# EAGLE design in3brain (EAGLE 7.7.0)
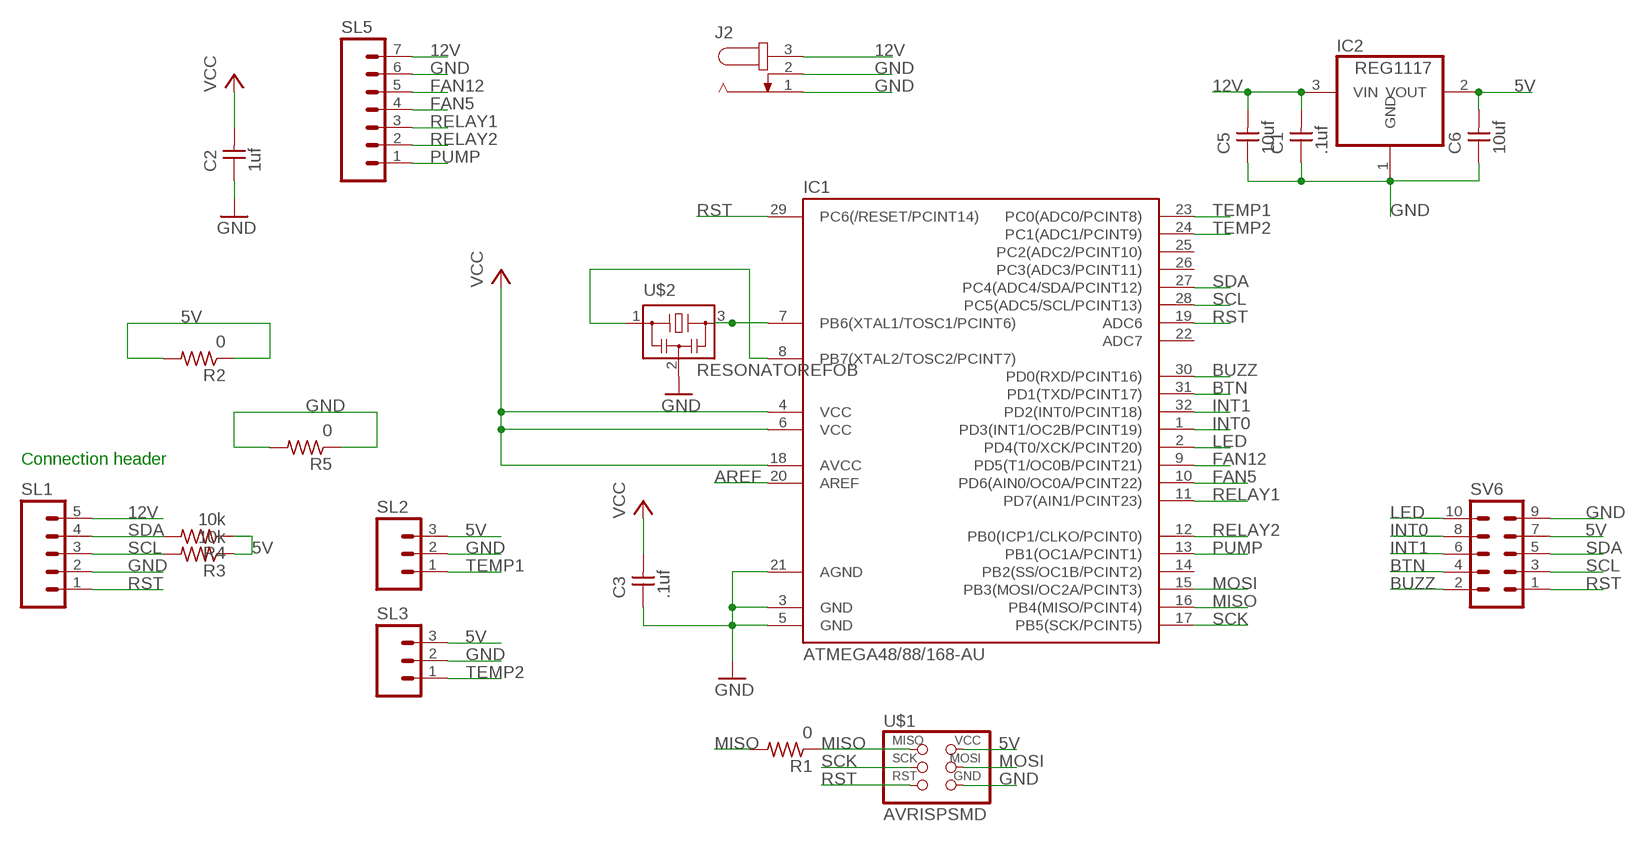
[diagram p0: schematic, sheet 1]

## Parts
C1  .1uf  UNPOLARIZED_CAPACITOR1206  [1206]
C2  1uf  UNPOLARIZED_CAPACITOR1206  [1206]
C3  .1uf  UNPOLARIZED_CAPACITOR1206  [1206]
C5  10uf  UNPOLARIZED_CAPACITOR1206  [1206]
C6  10uf  UNPOLARIZED_CAPACITOR1206  [1206]
IC1  ATMEGA48/88/168-AU  [TQFP32-08]
IC2  REG1117  [SOT223]
J2  JACK-PLUG1  [SPC4078]
R1  0  RESISTOR1206  [1206]
R2  0  RESISTOR1206  [1206]
R3  10k  RESISTOR1206  [1206]
R4  10k  RESISTOR1206  [1206]
R5  0  RESISTOR1206  [1206]
SL1  MA05  [05PA]
SL2  MA03  [03P]
SL3  MA03  [03P]
SL5  MA07  [07PA]
SV6  MA05-2  [MA05-2]
U$1  AVRISPSMD  [2X03SMD]
U$2  RESONATOREFOB  [EFOBM]

## Nets
5V: C2.2 C3.2 C6.2 IC1.4(VCC) IC1.6(VCC) IC1.18(AVCC) IC2.2(VOUT) R2.1 R2.2 R3.1 R4.1 SL2.3 SL3.3 SV6.7 U$1.2(VCC) ; supply symbol labelled VCC
12V: C1.2 C5.2 IC2.3(VIN) J2.3 SL1.5 SL5.7
AREF: IC1.20(AREF)
BTN: IC1.31(PD1(TXD/PCINT17)) SV6.4
BUZZ: IC1.30(PD0(RXD/PCINT16)) SV6.2
FAN5: IC1.10(PD6(AIN0/OC0A/PCINT22)) SL5.4
FAN12: IC1.9(PD5(T1/OC0B/PCINT21)) SL5.5
GND: C1.1 C2.1 C3.1 C5.1 C6.1 IC1.3(GND) IC1.5(GND) IC1.21(AGND) IC2.1(GND) J2.1 J2.2 R5.1 R5.2 SL1.2 SL2.2 SL3.2 SL5.6 SV6.9 U$1.6(GND) U$2.2
INT0: IC1.1(PD3(INT1/OC2B/PCINT19)) SV6.8
INT1: IC1.32(PD2(INT0/PCINT18)) SV6.6
LED: IC1.2(PD4(T0/XCK/PCINT20)) SV6.10
MISO: IC1.16(PB4(MISO/PCINT4)) R1.1 R1.2 U$1.1(MISO)
MOSI: IC1.15(PB3(MOSI/OC2A/PCINT3)) U$1.4(MOSI)
N$1: IC1.8(PB7(XTAL2/TOSC2/PCINT7)) U$2.1
N$9: IC1.7(PB6(XTAL1/TOSC1/PCINT6)) U$2.3
PUMP: IC1.13(PB1(OC1A/PCINT1)) SL5.1
RELAY1: IC1.11(PD7(AIN1/PCINT23)) SL5.3
RELAY2: IC1.12(PB0(ICP1/CLKO/PCINT0)) SL5.2
RST: IC1.19(ADC6) IC1.29(PC6(/RESET/PCINT14)) SL1.1 SV6.1 U$1.5(RST)
SCK: IC1.17(PB5(SCK/PCINT5)) U$1.3(SCK)
SCL: IC1.28(PC5(ADC5/SCL/PCINT13)) R3.2 SL1.3 SV6.3
SDA: IC1.27(PC4(ADC4/SDA/PCINT12)) R4.2 SL1.4 SV6.5
TEMP1: IC1.23(PC0(ADC0/PCINT8)) SL2.1
TEMP2: IC1.24(PC1(ADC1/PCINT9)) SL3.1
Unconnected: IC1.14(PB2(SS/OC1B/PCINT2)) IC1.22(ADC7) IC1.25(PC2(ADC2/PCINT10)) IC1.26(PC3(ADC3/PCINT11))

## Notes on the sheet
- Connection header

## Library data of the parts
C1-C3 C5 C6 = ng:UNPOLARIZED_CAPACITOR: unpolarized_capacitor
IC1 = atmega8:ATMEGA48/88/168
IC2 = burr-brown:REG1117: 800mA and 1A Low Dropout (LDO) Positive Regulator 1.8V, 2.5V, 2.85V, 3.3V, 5V, and Adj; MPN: REG1117; OC_FARNELL: 1097566; OC_NEWARK: 14P6981
J2 = con-jack:JACK-PLUG: DC POWER JACK Power Jack, DC, Right Angle, Through Hole, Rated 5A at 16VDC, PC Terminals Distributor: Farnell (www.Farnell.de) Drawing: 84N1161.pdf / 84N1162.pdf Manufacturer: SPC Technology (www.spctechnology.com) Type: SPC4077 / SPC 4078; OC_FARNELL: unknown; OC_NEWARK: unknown
R1-R5 = ng:RESISTOR
SL1 = con-amp-quick:MA05: AMP QUICK CONNECTOR; OC_FARNELL: unknown; OC_NEWARK: unknown
SL2 SL3 = con-amp-quick:MA03: AMP QUICK CONNECTOR; OC_FARNELL: unknown; OC_NEWARK: unknown
SL5 = con-amp-quick:MA07: AMP QUICK CONNECTOR; OC_FARNELL: unknown; OC_NEWARK: unknown
SV6 = con-lstb:MA05-2: PIN HEADER; OC_FARNELL: unknown; OC_NEWARK: unknown
U$1 = 01_FAB_Hello:AVRISP
U$2 = fab:RESONATOR

## Board
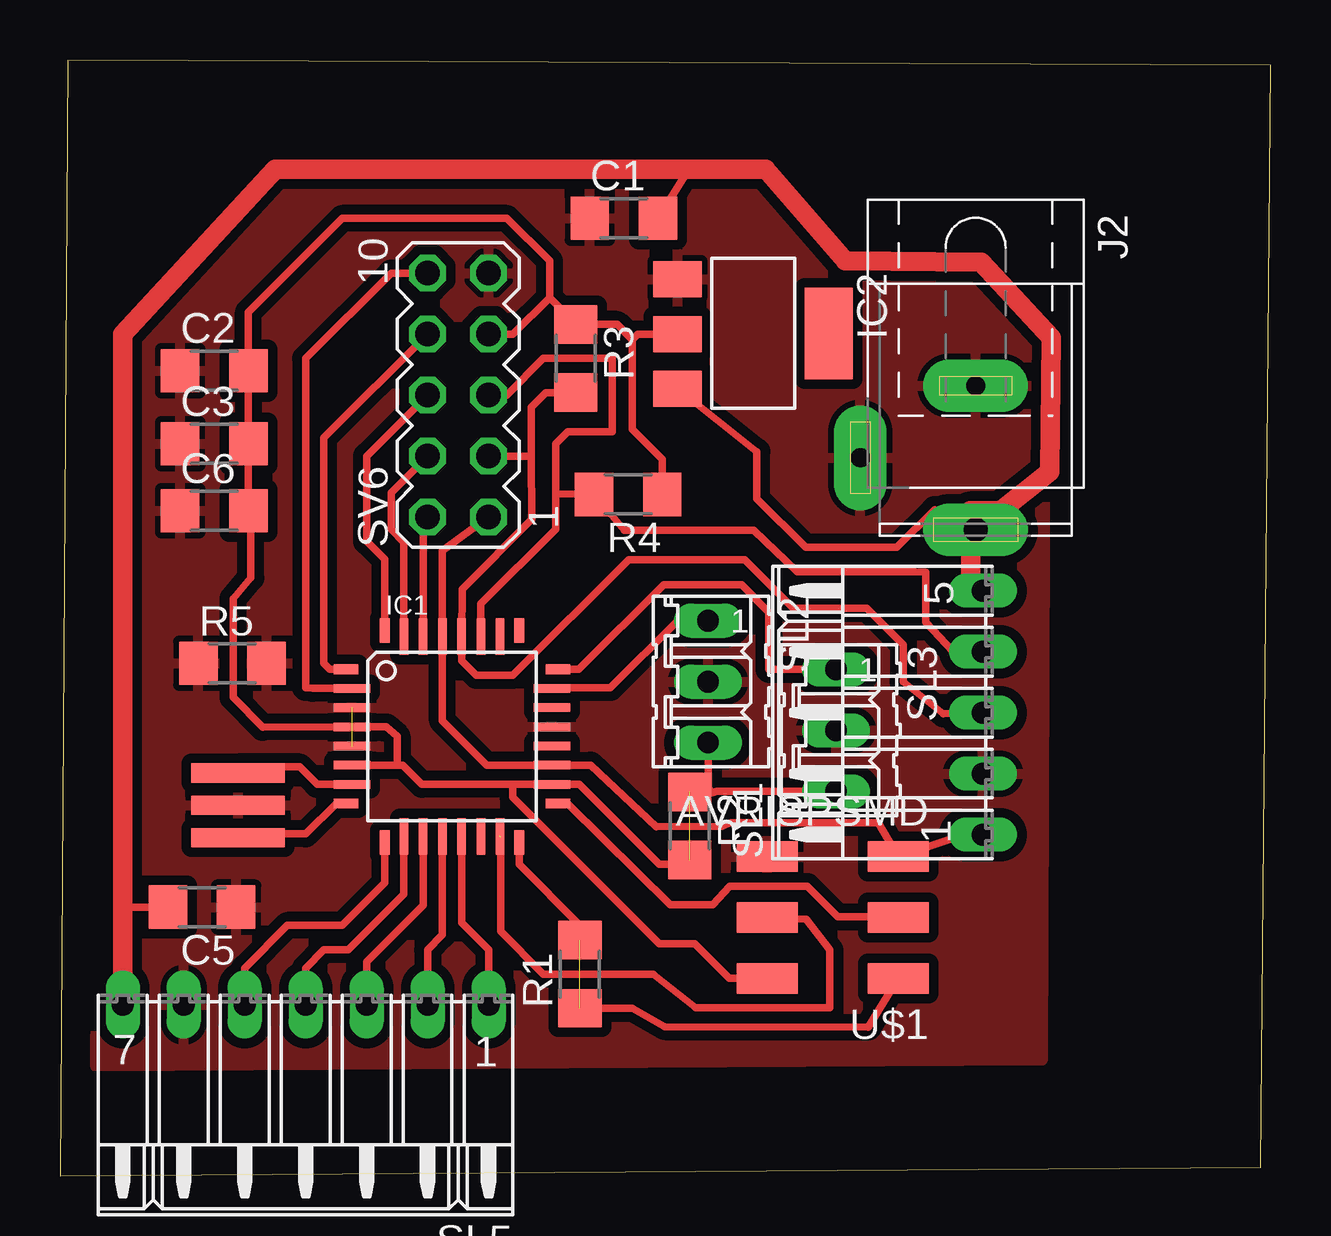
[diagram p1: board, top side]

Size 50.45 x 46.5 mm. Coordinates in mm from the lower left corner, seen from the top.
Outline: 0,0 50.04,0.36 50.45,46.28 0.33,46.5 0,0
Copper layers (1*16): Top 0.035mm / dielectric 1.5mm / Bottom 0.035mm
Design rules "default *": minimum track width 10mil, minimum drill 24mil, track to track 16mil, track to pad 16mil, pad to pad 16mil, via to via 16mil, smd to smd 16mil, copper to edge 40mil, drill to drill 16mil, minimum pad ring 10mil, minimum via ring 8mil, stop-mask expansion 4mil, vias tented up to drill 0mil, thermal gap 10mil

### Footprints (pad centres in the part's own frame; a part is rotated, then mirrored left to right if it is on the bottom)
1206 = smd 1.6 x 1.803: 1 -1.422,0; 2 1.422,0
TQFP32-08 = smd 1.016 x 0.406: 1 -4.42,2.8; 8 -4.42,-2.8; 17 4.42,-2.8; 24 4.42,2.8 | smd 1.524 x 0.356: 2 -4.166,2; 3 -4.166,1.2; 4 -4.166,0.4; 5 -4.166,-0.4; 6 -4.166,-1.2; 7 -4.166,-2; 18 4.166,-2; 19 4.166,-1.2; 20 4.166,-0.4; 21 4.166,0.4; 22 4.166,1.2; 23 4.166,2 | smd 0.406 x 1.016: 9 -2.8,-4.42; 16 2.8,-4.42; 25 2.8,4.42; 32 -2.8,4.42 | smd 0.356 x 1.524: 10 -2,-4.166; 11 -1.2,-4.166; 12 -0.4,-4.166; 13 0.4,-4.166; 14 1.2,-4.166; 15 2,-4.166; 26 2,4.166; 27 1.2,4.166; 28 0.4,4.166; 29 -0.4,4.166; 30 -1.2,4.166; 31 -2,4.166
SOT223 = smd 1.499 x 2.007: 1 -2.261,-3.15; 2 0.025,-3.15; 3 2.311,-3.15 | smd 3.81 x 2.007: 4 0,3.15
SPC4078 = drill 0.8 pad 2.184 long: 1 -3,0; 2 0,-4.8 | drill 1 pad 2.184 long: 3 3,0
05PA = drill 0.914 long: 1 -5.08,0; 2 -2.54,0; 3 0,0; 4 2.54,0; 5 5.08,0
03P = drill 0.914 long: 1 -2.54,0; 2 0,0; 3 2.54,0
07PA = drill 0.914 long: 1 -7.62,0; 2 -5.08,0; 3 -2.54,0; 4 0,0; 5 2.54,0; 6 5.08,0; 7 7.62,0
MA05-2 = drill 1.016 octagon: 1 -5.08,-1.27; 2 -5.08,1.27; 3 -2.54,-1.27; 4 -2.54,1.27; 5 0,-1.27; 6 0,1.27; 7 2.54,-1.27; 8 2.54,1.27; 9 5.08,-1.27; 10 5.08,1.27
2X03SMD = smd 2.54 x 1.27: 1 -2.54,2.54; 2 2.92,2.54; 3 -2.54,0; 4 2.92,0; 5 -2.54,-2.54; 6 2.92,-2.54
EFOBM = smd 0.8 x 3.9: 1 -1.35,0; 2 0,0; 3 1.35,0

### Placement (x,y rotation side)
C1  23.5,39.9 0 top
C2  6.43,33.55 0 top
C3  6.43,30.51 0 top
C5  5.92,11.2 180 top
C6  6.43,27.71 0 top
IC1  16.33,18.31 0 top
IC2  28.88,35.1 270 top
J2  38.15,29.92 270 top
R1  21.67,8.41 90 top
R2  26.24,14.58 270 top
R3  21.49,34.06 270 top
R4  23.67,28.4 180 top
R5  7.19,21.36 0 top
SL1  38.46,19.3 90 top
SL2  27,20.6 270 top
SL3  32.33,18.57 270 top
SL5  10.24,7.14 180 top
SV6  16.59,32.54 90 top
U$1  32.38,10.77 180 top
U$2  7.42,15.44 90 top

### Tracks (layer width: path | path; a pad name or v marks a point on that pad's centre or on a via)
5V  (1 unrouted)
  Top 0.305: 18.87,16.31 15.08,16.31 14.28,17.11 14.05,17.11 | 14.05,17.11 14.05,18.31 13.6,18.71 IC1.4 8.44,18.69 7.21,19.94 7.21,24.05 7.95,24.92 7.95,27.61 C6.2 C3.2 C2.2 7.85,35.99 11.76,39.9 18.62,39.9 20.4,38.13 20.4,36.6 | SV6.7 18.87,35.08 20.4,36.6 | 18.87,16.31 18.87,15.77 24.97,9.68 26.44,9.68 27.89,8.23 U$1.2 | 20.4,36.6 21.51,35.48 R3.1 21.11,35.48 23.22,35.48 23.85,34.85 | R2.2 26.85,12.98 24.97,12.98 21.63,16.31 IC1.18 18.87,16.31 | SL3.3 27.36,16.03 27.18,15.97 | 27.18,15.97 R2.1 | IC1.6 13.98,17.11 14.05,17.11 | SL2.3 27,16.15 27.18,15.97 | R4.1 25.1,29.87 23.85,31.12 23.85,34.85 | IC2.2 24.08,35.08 23.85,34.85
12V
  Top 0.305: IC2.3 29.03,30.18 29.03,28.22 31.06,26.19 34.87,26.19 36.45,27.76 J2.3 36.7,27.71 37.92,27.71 | C1.2 26.14,41.83 24.71,41.94 | C5.2 2.62,11.2
  Top 0.813: SL5.7 2.62,11.2 2.62,35.08 8.97,41.94 24.71,41.94 29.41,41.94 32.72,38.13 38.38,38.07 41.3,34.93 41.25,29.34 39.19,27.71 37.92,27.71 37.95,24.43 SL1.5
BTN
  Top 0.305: SV6.4 13.79,28.47 13.79,26.95 14.33,26.41 IC1.31
BUZZ
  Top 0.305: SV6.2 15.13,27.35 IC1.30
FAN5
  Top 0.305: SL5.4 10.24,8.66 11,9.42 12.01,9.42 14.33,11.74 IC1.10
FAN12
  Top 0.305: SL5.5 7.7,8.66 9.47,10.44 11.76,10.44 13.53,12.21 IC1.9
GND  (1 unrouted)
  pour Top: 1.75,42.65 41.1,42.57 40.94,4.8 1.47,4.55
INT0
  Top 0.305: SV6.8 11,30.76 11,21.36 11.25,21.11 IC1.1
INT1
  Top 0.305: SV6.6 12.78,30 12.78,26.44 13.53,25.69 IC1.32
LED
  Top 0.305: SV6.10 13.79,37.62 10.24,34.06 10.24,20.35 10.52,20.31 IC1.2
MISO  (1 unrouted)
  Top 0.305: R1.2 21.67,10.44 19.13,12.98 IC1.16 | R1.1 23.85,6.99 25.2,6.22 33.68,6.2 U$1.1
MOSI  (1 unrouted)
  Top 0.305: U$1.4 31.09,10.69 32.08,9.42 32.08,7.01 26.49,7.01 24.71,8.41 20.14,8.41 18.36,10.19 18.36,14.12
N$1
  Top 0.305: IC1.8 11.5,15.51 10.24,14.25 7.51,14.25 U$2.1
N$9
  Top 0.305: U$2.3 7.42,17.04 9.98,17.04 10.71,16.31 IC1.7
PUMP
  Top 0.305: SL5.1 17.86,9.42 16.73,10.55 IC1.13
RELAY1
  Top 0.305: SL5.3 12.78,8.92 15.13,11.27 IC1.11
RELAY2
  Top 0.305: SL5.2 15.32,9.42 15.93,10.04 IC1.12
RST
  Top 0.305: SV6.1 15.93,26.04 IC1.29 15.93,18.97 17.79,17.11 IC1.19 22.1,17.11 24.84,14.55 27.58,14.58 27.94,14.71 34.09,14.71 U$1.5 37.54,14.17 SL1.1
SCK
  Top 0.305: IC1.17 21.16,15.51 22.63,14.05 25.43,11.3 27.2,11.3 27.91,12.07 31.14,12.07 32.41,10.8 34.9,10.8 U$1.3
SCL
  Top 0.305: 19.63,30 19.66,27.36 16.76,24.45 IC1.28 16.73,21.47 17.35,20.85 18.87,20.85 23.7,25.68 28.52,25.68 30.56,23.65 33.6,23.65 35.13,22.12 35.13,20.6 36.8,19.25 SL1.3 | 19.63,30 SV6.3 | R3.2 20.24,32.64 19.63,32.03 19.63,30
SDA
  Top 0.305: IC1.27 17.53,23.83 20.65,26.95 20.65,28.42 | SL1.4 37.21,21.84 36.07,23.06 36.07,25.15 35.64,25.17 30.71,25.17 28.91,26.9 23.52,26.9 R4.2 20.65,28.42 | SV6.5 18.62,32.54 20.14,34.06 23.01,34.06 23.01,31.01 21.16,31.01 20.65,30.51 20.65,28.42
TEMP1
  Top 0.305: SL2.1 25.73,23.14 22.94,20.35 20.53,20.35 IC1.23
TEMP2
  Top 0.305: SL3.1 29.54,21.11 29.54,23.5 28.4,24.64 25.15,24.64 21.62,21.11 IC1.24